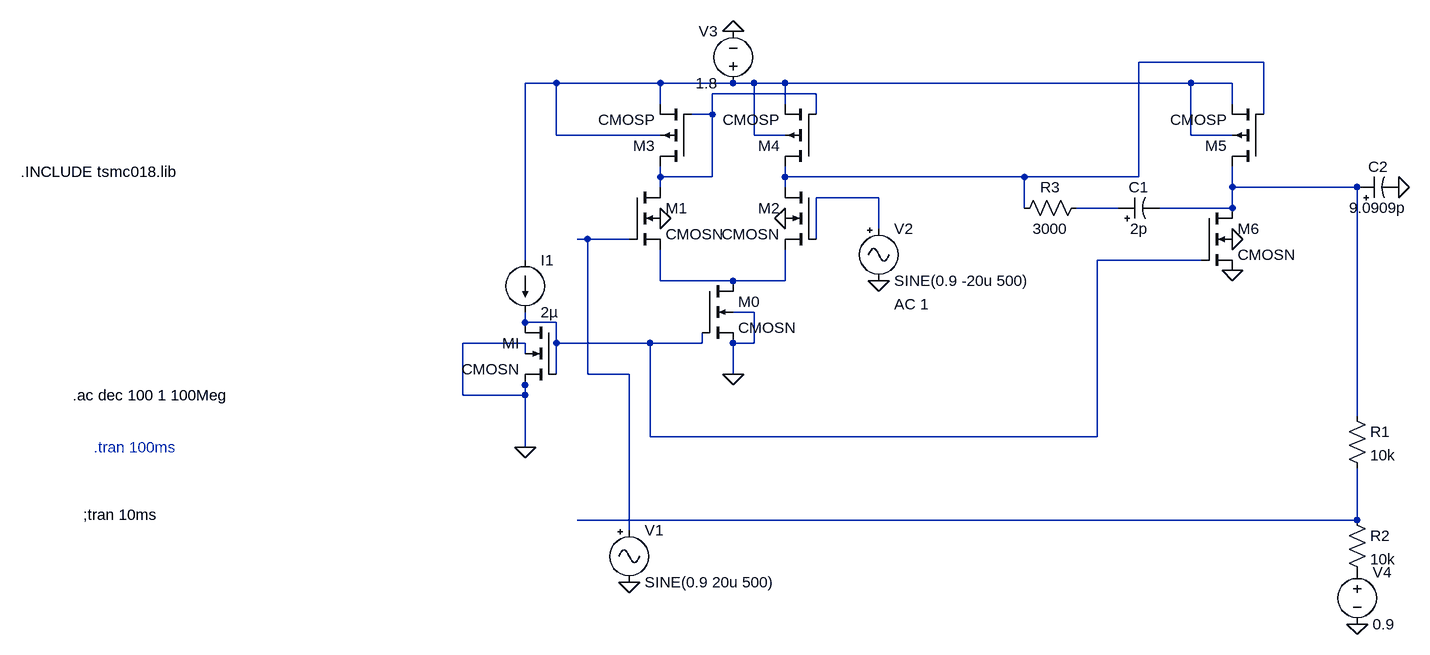
[diagram p0: schematic ota new (2).asc]
ota new (2).asc, the LTspice schematic file:
Version 4
SHEET 1 1316 916
WIRE 1072 32 880 32
WIRE -16 64 -64 64
WIRE 144 64 -16 64
WIRE 256 64 144 64
WIRE 288 64 256 64
WIRE 336 64 288 64
WIRE 960 64 336 64
WIRE 1024 64 960 64
WIRE 384 80 224 80
WIRE 144 96 144 64
WIRE 336 96 336 64
WIRE 1024 96 1024 64
WIRE 224 112 224 80
WIRE 224 112 192 112
WIRE 384 112 384 80
WIRE 1072 112 1072 32
WIRE -16 144 -16 64
WIRE 144 144 -16 144
WIRE 288 144 288 64
WIRE 336 144 288 144
WIRE 960 144 960 64
WIRE 1024 144 960 144
WIRE 144 208 144 192
WIRE 224 208 224 112
WIRE 224 208 144 208
WIRE 336 208 336 192
WIRE 704 208 336 208
WIRE 880 208 880 32
WIRE 880 208 704 208
WIRE 144 224 144 208
WIRE 336 224 336 208
WIRE 1024 224 1024 192
WIRE 1216 224 1024 224
WIRE 480 240 384 240
WIRE 704 256 704 208
WIRE 848 256 784 256
WIRE 1024 256 1024 224
WIRE 1024 256 912 256
WIRE 480 288 480 240
WIRE 32 304 16 304
WIRE 96 304 32 304
WIRE 384 304 384 240
WIRE -64 336 -64 64
WIRE 976 336 816 336
WIRE 144 368 144 320
WIRE 256 368 144 368
WIRE 336 368 336 320
WIRE 336 368 256 368
WIRE 288 416 256 416
WIRE -64 432 -64 416
WIRE -16 432 -64 432
WIRE -64 464 -160 464
WIRE -16 464 -16 432
WIRE 128 464 -16 464
WIRE 208 464 208 448
WIRE 208 464 128 464
WIRE 288 464 288 416
WIRE 288 464 256 464
WIRE -64 480 -64 464
WIRE -16 512 -16 464
WIRE 32 512 32 304
WIRE 96 512 32 512
WIRE 256 512 256 464
WIRE -64 528 -64 512
WIRE -160 544 -160 464
WIRE -64 544 -64 528
WIRE -64 544 -160 544
WIRE 1216 576 1216 224
WIRE 128 608 128 464
WIRE 816 608 816 336
WIRE 816 608 128 608
WIRE -64 624 -64 544
WIRE 1216 736 1216 656
WIRE 1216 736 16 736
WIRE 96 752 96 512
FLAG 256 -16 0
FLAG -64 624 0
FLAG 144 272 0
FLAG 256 512 0
FLAG 336 272 0
FLAG 1024 352 0
FLAG 1024 304 0
FLAG 96 832 0
FLAG 480 368 0
FLAG 1216 896 0
FLAG 1280 224 0
SYMBOL cmosn 96 224 R0
SYMATTR InstName M1
SYMATTR Value2 l=0.9u w=12.23u
SYMBOL cmosn 208 368 R0
SYMATTR InstName M0
SYMATTR Value2 l=0.9u w=3.913u
SYMBOL voltage 256 80 R180
WINDOW 0 24 96 Left 2
WINDOW 3 24 16 Left 2
WINDOW 123 0 0 Left 2
WINDOW 39 0 0 Left 2
SYMATTR InstName V3
SYMATTR Value 1.8
SYMBOL current -64 336 R0
WINDOW 123 0 0 Left 2
WINDOW 39 0 0 Left 2
SYMATTR InstName I1
SYMATTR Value 2µ
SYMBOL cmosn 384 224 M0
SYMATTR InstName M2
SYMATTR Value2 l=0.9u w=12.23u
SYMBOL cmosn -16 432 M0
SYMATTR InstName MI
SYMATTR Value2 l=0.9u w=0.391u
SYMBOL cmosn 976 256 R0
SYMATTR InstName M6
SYMATTR Value2 l=0.18u w=1.9566u
SYMBOL cmosp 1072 192 R180
SYMATTR InstName M5
SYMATTR Value2 l=0.18u w=4.5u
SYMBOL cmosp 192 192 R180
SYMATTR InstName M3
SYMATTR Value2 l=0.9u w=4.5u
SYMBOL cmosp 384 192 R180
SYMATTR InstName M4
SYMATTR Value2 l=0.9u w=4.5u
SYMBOL Misc\\signal 480 272 R0
WINDOW 123 24 132 Left 2
WINDOW 39 0 0 Left 2
SYMATTR Value2 AC 1
SYMATTR InstName V2
SYMATTR Value SINE(0.9 -20u 500)
SYMBOL Misc\\signal 96 736 R0
WINDOW 123 24 132 Left 2
WINDOW 39 0 0 Left 2
SYMATTR InstName V1
SYMATTR Value SINE(0.9 20u 500)
SYMBOL polcap 848 272 R270
WINDOW 0 32 32 VTop 2
WINDOW 3 0 32 VBottom 2
SYMATTR InstName C1
SYMATTR Value 2p
SYMATTR Description Capacitor
SYMATTR Type cap
SYMATTR SpiceLine V=6.3 Irms=0 Rser=4 Lser=0
SYMBOL res 1200 560 R0
SYMATTR InstName R1
SYMATTR Value 10k
SYMBOL res 1200 720 R0
SYMATTR InstName R2
SYMATTR Value 10k
SYMBOL polcap 1216 240 R270
WINDOW 0 32 32 VTop 2
WINDOW 3 0 32 VBottom 2
SYMATTR InstName C2
SYMATTR Value 9.0909p
SYMATTR Description Capacitor
SYMATTR Type cap
SYMATTR SpiceLine V=6.3 Irms=0 Rser=4 Lser=0
SYMBOL voltage 1216 800 R0
WINDOW 123 0 0 Left 2
WINDOW 39 0 0 Left 2
SYMATTR InstName V4
SYMATTR Value 0.9
SYMBOL res 688 272 R270
WINDOW 0 32 56 VTop 2
WINDOW 3 0 56 VBottom 2
SYMATTR InstName R3
SYMATTR Value 3000
TEXT -840 200 Left 2 !.INCLUDE tsmc018.lib
TEXT -744 728 Left 2 !;tran 10ms
TEXT -760 544 Left 2 !.ac dec 100 1 100Meg
TEXT -728 624 Left 2 ;.tran 100ms

The netlist it stands for:
* ota new (2).asc
M1 N003 N007 N009 0 CMOSN l=0.9u w=12.23u
M0 N009 N008 0 0 CMOSN l=0.9u w=3.913u
V3 N002 0 1.8
I1 N002 N008 2µ
M2 N001 N005 N009 0 CMOSN l=0.9u w=12.23u
MI N008 N008 0 0 CMOSN l=0.9u w=0.391u
M6 N004 N008 0 0 CMOSN l=0.18u w=1.9566u
M5 N004 N001 N002 N002 CMOSP l=0.18u w=4.5u
M3 N003 N003 N002 N002 CMOSP l=0.9u w=4.5u
M4 N001 N003 N002 N002 CMOSP l=0.9u w=4.5u
V2 N005 0 SINE(0.9 -20u 500) AC 1
V1 N007 0 SINE(0.9 20u 500)
C1 N006 N004 2p V=6.3 Irms=0 Rser=4 Lser=0
R1 N004 N010 10k
R2 N010 P001 10k
C2 N004 0 9.0909p V=6.3 Irms=0 Rser=4 Lser=0
V4 P001 0 0.9
R3 N001 N006 3000
.model NMOS NMOS
.model PMOS PMOS
.lib standard.mos
.INCLUDE tsmc018.lib
;tran 10ms
.ac dec 100 1 100Meg
* .tran 100ms
.backanno
.end